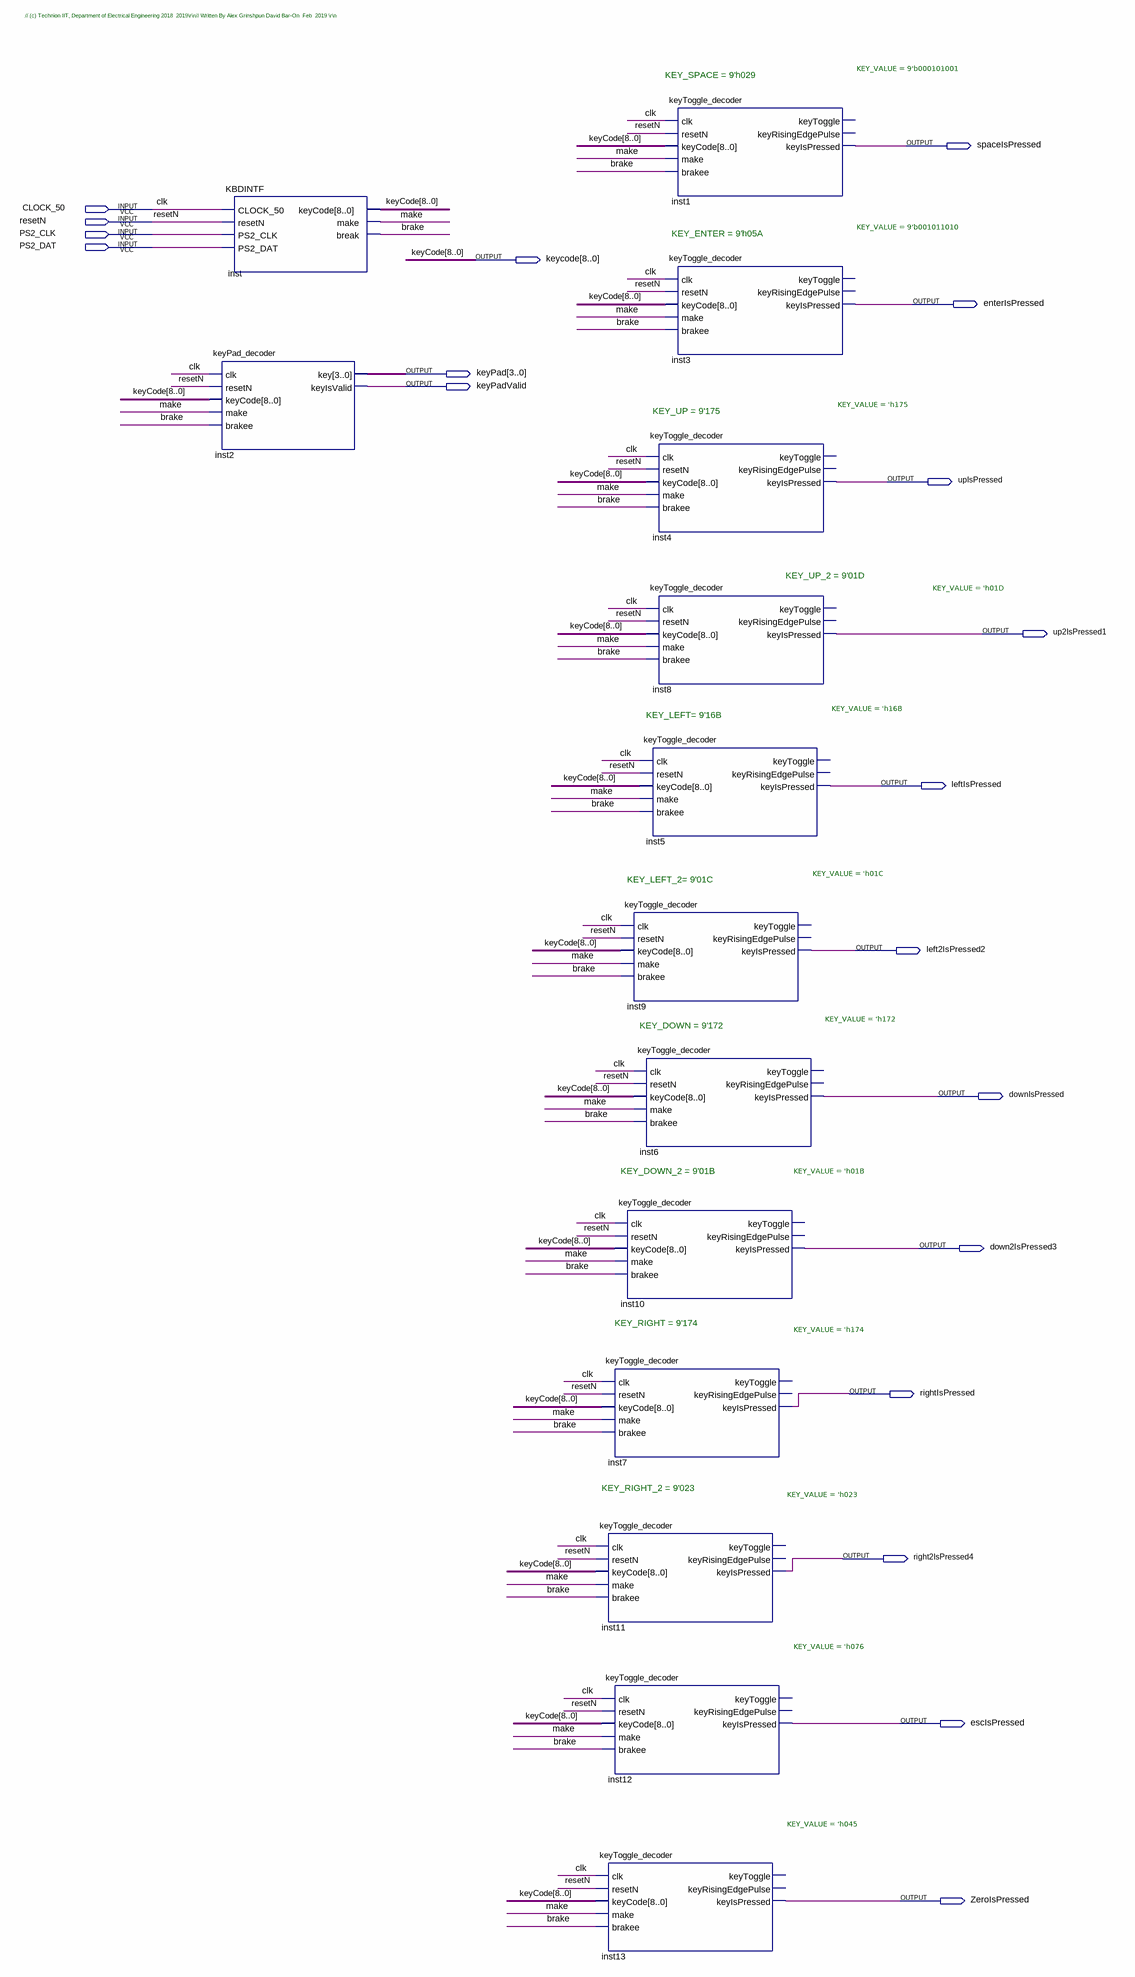
[diagram p0: schematic sheet]
// Quartus schematic TOP_KBD_DEMOALL.bdf as structural Verilog: 14 symbols, 19 pins
module TOP_KBD_DEMOALL (
  input  CLOCK_50,
  input  resetN,
  input  PS2_CLK,
  input  PS2_DAT,
  output spaceIsPressed,
  output [8:0] keycode,
  output enterIsPressed,
  output [3:0] keyPad,
  output keyPadValid,
  output upIsPressed,
  output up2IsPressed1,
  output leftIsPressed,
  output left2IsPressed2,
  output downIsPressed,
  output down2IsPressed3,
  output rightIsPressed,
  output right2IsPressed4,
  output escIsPressed,
  output ZeroIsPressed
);

  wire brake, make;

  KBDINTF inst (
    .CLOCK_50(CLOCK_50), .resetN(resetN), .PS2_CLK(PS2_CLK), .PS2_DAT(PS2_DAT), .keyCode(keycode),
    .make(make), .\break (brake));
  keyPad_decoder inst2 (
    .clk(CLOCK_50), .resetN(resetN), .keyCode(keycode), .make(make), .brakee(brake), .key(keyPad),
    .keyIsValid(keyPadValid));
  keyToggle_decoder #(.KEY_VALUE('h16B)) inst5 (
    .clk(CLOCK_50), .resetN(resetN), .keyCode(keycode), .make(make), .brakee(brake),
    .keyIsPressed(leftIsPressed));  // open: keyToggle, keyRisingEdgePulse
  keyToggle_decoder #(.KEY_VALUE('h01C)) inst9 (
    .clk(CLOCK_50), .resetN(resetN), .keyCode(keycode), .make(make), .brakee(brake),
    .keyIsPressed(left2IsPressed2));  // open: keyToggle, keyRisingEdgePulse
  keyToggle_decoder #(.KEY_VALUE('h172)) inst6 (
    .clk(CLOCK_50), .resetN(resetN), .keyCode(keycode), .make(make), .brakee(brake),
    .keyIsPressed(downIsPressed));  // open: keyToggle, keyRisingEdgePulse
  keyToggle_decoder #(.KEY_VALUE('h01B)) inst10 (
    .clk(CLOCK_50), .resetN(resetN), .keyCode(keycode), .make(make), .brakee(brake),
    .keyIsPressed(down2IsPressed3));  // open: keyToggle, keyRisingEdgePulse
  keyToggle_decoder #(.KEY_VALUE('h174)) inst7 (
    .clk(CLOCK_50), .resetN(resetN), .keyCode(keycode), .make(make), .brakee(brake),
    .keyIsPressed(rightIsPressed));  // open: keyToggle, keyRisingEdgePulse
  keyToggle_decoder #(.KEY_VALUE('h023)) inst11 (
    .clk(CLOCK_50), .resetN(resetN), .keyCode(keycode), .make(make), .brakee(brake),
    .keyIsPressed(right2IsPressed4));  // open: keyToggle, keyRisingEdgePulse
  keyToggle_decoder #(.KEY_VALUE('h076)) inst12 (
    .clk(CLOCK_50), .resetN(resetN), .keyCode(keycode), .make(make), .brakee(brake),
    .keyIsPressed(escIsPressed));  // open: keyToggle, keyRisingEdgePulse
  keyToggle_decoder #(.KEY_VALUE('h045)) inst13 (
    .clk(CLOCK_50), .resetN(resetN), .keyCode(keycode), .make(make), .brakee(brake),
    .keyIsPressed(ZeroIsPressed));  // open: keyToggle, keyRisingEdgePulse
  keyToggle_decoder #(.KEY_VALUE(9'b000101001)) inst1 (
    .clk(CLOCK_50), .resetN(resetN), .keyCode(keycode), .make(make), .brakee(brake),
    .keyIsPressed(spaceIsPressed));  // open: keyToggle, keyRisingEdgePulse
  keyToggle_decoder #(.KEY_VALUE(9'b001011010)) inst3 (
    .clk(CLOCK_50), .resetN(resetN), .keyCode(keycode), .make(make), .brakee(brake),
    .keyIsPressed(enterIsPressed));  // open: keyToggle, keyRisingEdgePulse
  keyToggle_decoder #(.KEY_VALUE('h175)) inst4 (
    .clk(CLOCK_50), .resetN(resetN), .keyCode(keycode), .make(make), .brakee(brake),
    .keyIsPressed(upIsPressed));  // open: keyToggle, keyRisingEdgePulse
  keyToggle_decoder #(.KEY_VALUE('h01D)) inst8 (
    .clk(CLOCK_50), .resetN(resetN), .keyCode(keycode), .make(make), .brakee(brake),
    .keyIsPressed(up2IsPressed1));  // open: keyToggle, keyRisingEdgePulse

  // Other names for the same wires on the sheet: clk = CLOCK_50

  // Notes on the sheet:
  //   // (c) Technion IIT, Department of Electrical Engineering 2018  2019\r\n// Written By Alex Grinshpun David Bar-On  Feb  2019 \r\n
  //   KEY_SPACE = 9'h029
  //   KEY_ENTER = 9'h05A
  //   KEY_UP = 9'175
  //   KEY_UP_2 = 9'01D
  //   KEY_LEFT= 9'16B
  //   KEY_LEFT_2= 9'01C
  //   KEY_DOWN = 9'172
  //   KEY_DOWN_2 = 9'01B
  //   KEY_RIGHT = 9'174
  //   KEY_RIGHT_2 = 9'023
endmodule
